# EAGLE design USB_Isolator (EAGLE 5.06)
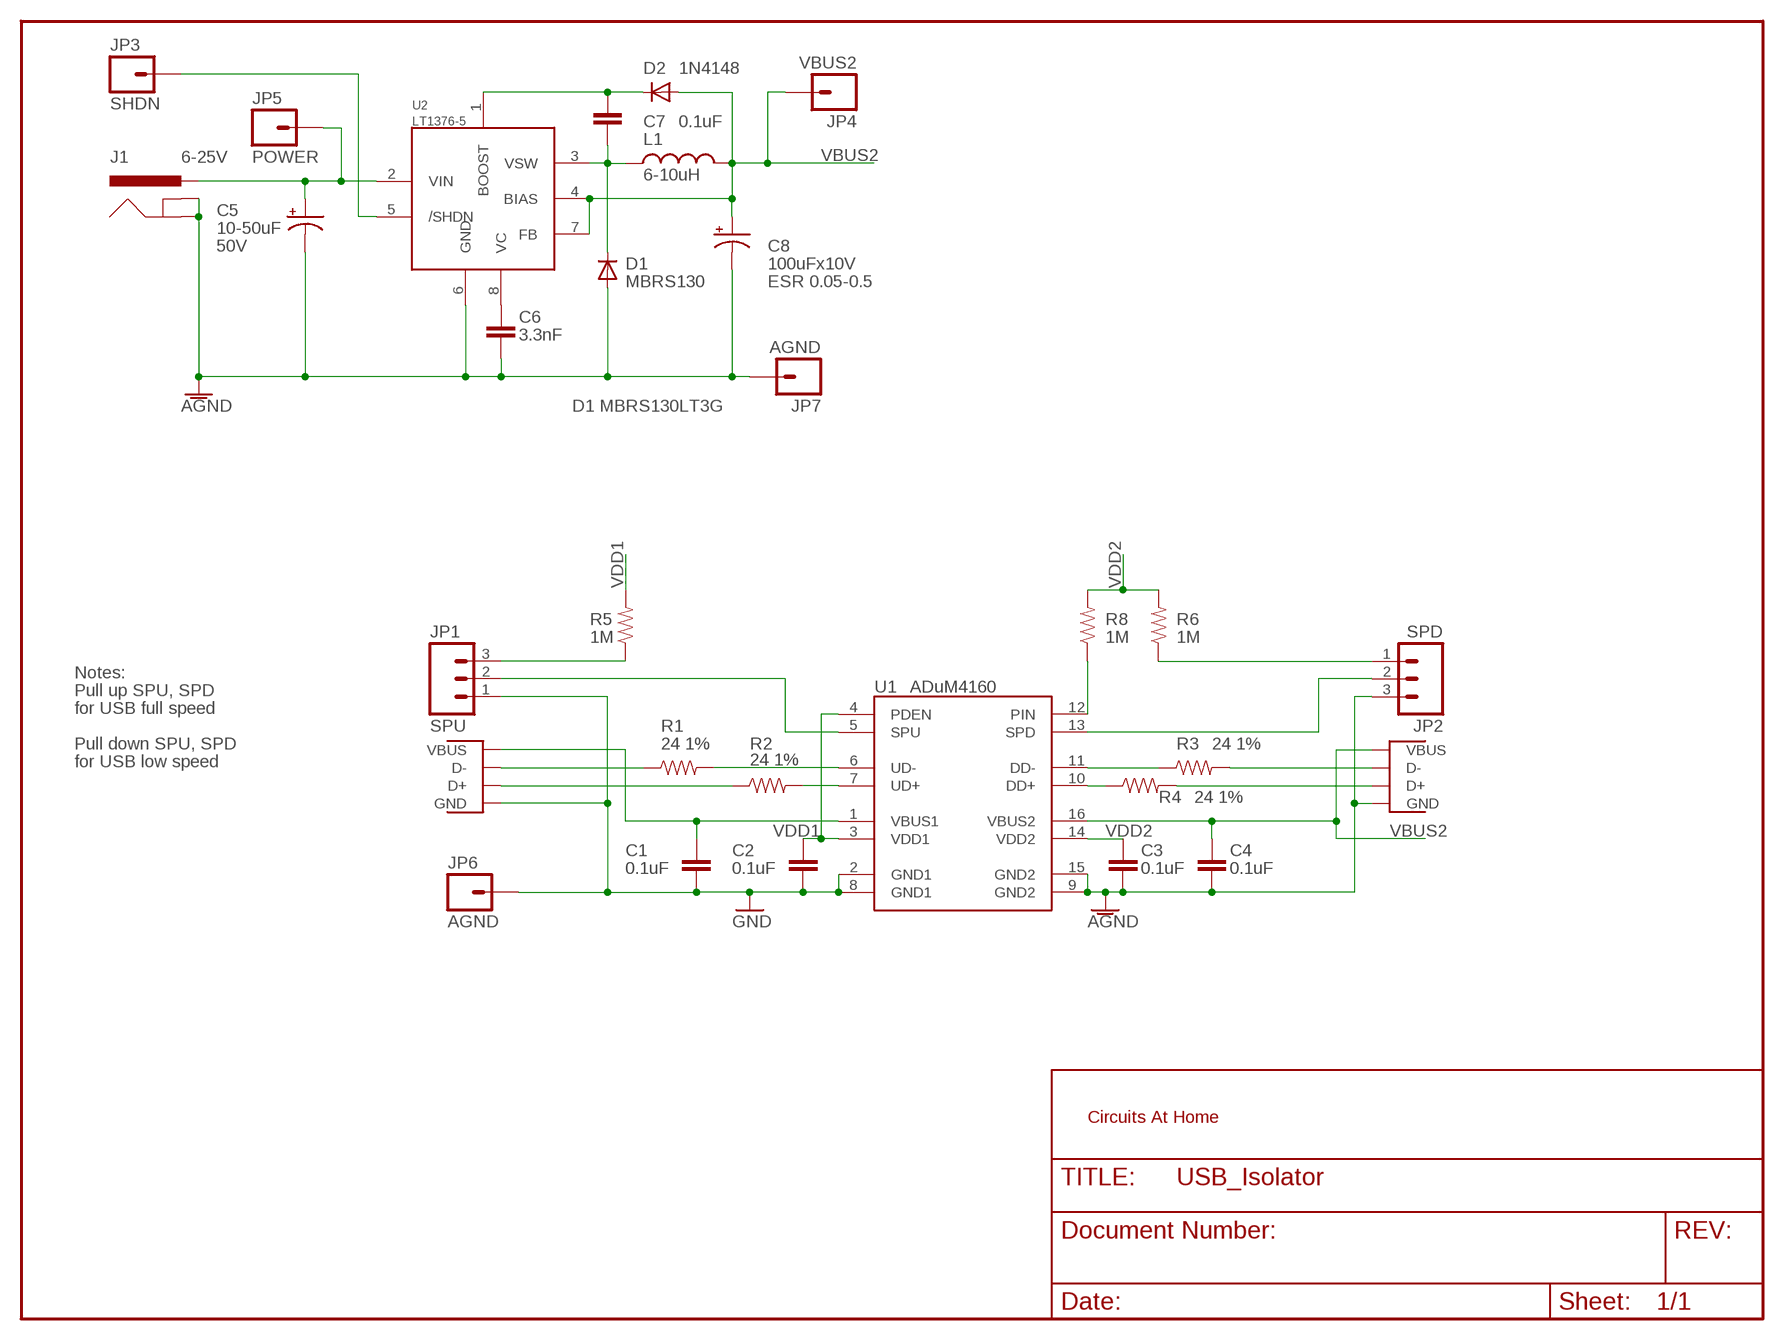
[diagram p0: schematic, sheet 1]

## Parts
C1  0.1uF  CAP1206  [1206]
C2  0.1uF  CAP1206  [1206]
C3  0.1uF  CAP1206  [1206]
C4  0.1uF  CAP1206  [1206]
C5  10-50uF  CAP_POL7343  [EIA7343]
C6  3.3nF  CAP1206  [1206]
C7  0.1uF  CAP1206  [1206]
C8  100uFx10V  CAP_POL7343  [EIA7343]
D1  MBRS130  DIODE-403A  [403A]
D2  1N4148  DIODE-SOD123  [SOD-123]
J1  6-25V  POWER_JACKPTH  [POWER_JACK_PTH]
JP1  SPU  M03PTH  [1X03]
JP2  SPD  M03PTH  [1X03]
JP3  SHDN  M01PTH  [1X01]
JP4  VBUS2  M01PTH  [1X01]
JP5  POWER  M01PTH  [1X01]
JP6  AGND  M01PTH  [1X01]
JP7  AGND  M01PTH  [1X01]
L1  6-10uH  INDUCTOR-CDRH5D18  [CDRH5D18]
R1  24 1%  RESISTOR1206  [1206]
R2  24 1%  RESISTOR1206  [1206]
R3  24 1%  RESISTOR1206  [1206]
R4  24 1%  RESISTOR1206  [1206]
R5  1M  RESISTOR1206  [1206]
R6  1M  RESISTOR1206  [1206]
R8  1M  RESISTOR1206  [1206]
U1  ADuM4160  ADUM4160  [SO16W]
U2  LT1376-5  LT1376-SO  [SO08]
X1  USB U  USBPTH  [USB-B-PTH]
X2  USB D  USB-A-H  [USB-A-H]

## Nets
AGND: C3.2 C4.2 C5.C(-) C6.1 C8.C(-) D1.A J1.GND J1.GNDBREAK JP2.3 JP7.1 U1.9(GND2) U1.15(GND2) U2.6(GND) X2.GND
BOOST: C7.2 D2.K(C) U2.1(BOOST)
GND: C1.2 C2.2 JP1.1 JP6.1 U1.2(GND1) U1.8(GND1) X1.GND
N$1: R1.1 X1.D-
N$2: R2.1 X1.D+
N$3: R3.2 X2.D-
N$4: R4.2 X2.D+
N$5: R2.2 U1.7(UD+)
N$7: R1.2 U1.6(UD-)
N$8: JP1.3 R5.1
N$9: JP2.1 R6.1
N$10: C5.A(+) J1.PWR JP5.1 U2.2(VIN)
N$11: R4.1 U1.10(DD+)
N$13: JP1.2 U1.5(SPU)
N$14: R8.1 U1.12(PIN)
N$15: JP2.2 U1.13(SPD)
N$16: R3.1 U1.11(DD-)
N$18: JP3.1 U2.5(/SHDN)
N$19: C6.2 U2.8(VC)
N$21: C7.1 D1.C L1.1 U2.3(VSW)
VBUS1: C1.1 U1.1(VBUS1) X1.VBUS
VBUS2: C4.1 C8.A(+) D2.A JP4.1 L1.2 U1.16(VBUS2) U2.4(BIAS) U2.7(FB) X2.VBUS
VDD1: C2.1 R5.2 U1.3(VDD1) U1.4(PDEN)
VDD2: C3.1 R6.2 R8.2 U1.14(VDD2)

## Notes on the sheet
- 50V
- ESR 0.05-0.5
- D1 MBRS130LT3G
- Notes:
- Pull up SPU, SPD
- for USB full speed
- Pull down SPU, SPD
- for USB low speed

## Library data of the parts
C1-C4 C6 C7 = CH_passive:CAP: Capacitor Standard 0603 ceramic capacitor, and 0.1" leaded capacitor.
C5 C8 = CH_passive:CAP_POL: Capacitor Polarized These are standard SMD and PTH capacitors. Normally 10uF, 47uF, and 100uF in electrolytic and tantalum varieties. Always verify the external diameter of the through hole cap, it varies with capacity, voltage, and manufacturer. The EIA devices should be standard.
D1 D2 = CH_semiconductors:DIODE: Diode These are standard reverse protection diodes and small signal diodes. SMA package can handle up to about 1A. SOD-323 can handle about 200mA. What the SOD-323 package when ordering, there are some mfgs out there that are 5-pin packages.
J1 = CH_connectors:POWER_JACK: Power Jack This is the standard 5.5mm barrel jack for power. The PTH is the most common, proven, reliable, footprint. All others are experimental. The Slot footprint only works if the mill layer is transmitted to the PCB fab house so be warned. Spark Fun Electronics SKU : PRT-00119. Mating wall wart : TOL-00298 (and others)
JP1 JP2 = CH_connectors:M03: Header 3 Standard 3-pin 0.1" header. Use with straight break away headers (SKU : PRT-00116), right angle break away headers (PRT-00553), swiss pins (PRT-00743), machine pins (PRT-00117), and female headers (PRT-00115). Molex polarized connector foot print use with SKU : PRT-08232 with associated crimp pins and housings.
JP3-JP7 = CH_connectors:M01: Header 1 Standard 1-pin 0.1" header. Use with straight break away headers (SKU : PRT-00116), right angle break away headers (PRT-00553), swiss pins (PRT-00743), machine pins (PRT-00117), and female headers (PRT-00115).
L1 = CH_passive:INDUCTOR: Inductors Basic Inductor
R1-R6 R8 = CH_passive:RESISTOR: Resistor Basic schematic elements and footprints for 0603, 1206, and PTH 1/10th watt (small) resistors.
U1 = CH_Analog_Devices:ADUM4160: Analog Devices Low/Full Speed USB Isolator
U2 = CH_Linear_technology:LT1376: Linear Technology 1.5A 500kHz Step-down switching regulator
X1 X2 = CH_connectors:USB: USB Connectors USB-B-PTH is fully proven SKU : PRT-00139 USB-miniB is fully proven SKU : PRT-00587 USB-A-PCB is untested. USB-A-H is C@H proven USB-B-SMT is throughly reviewed, but untested. Needs silkscreen touching up. USB-A-S has not been used/tested USB-MB-H has not been used/tested

## Board
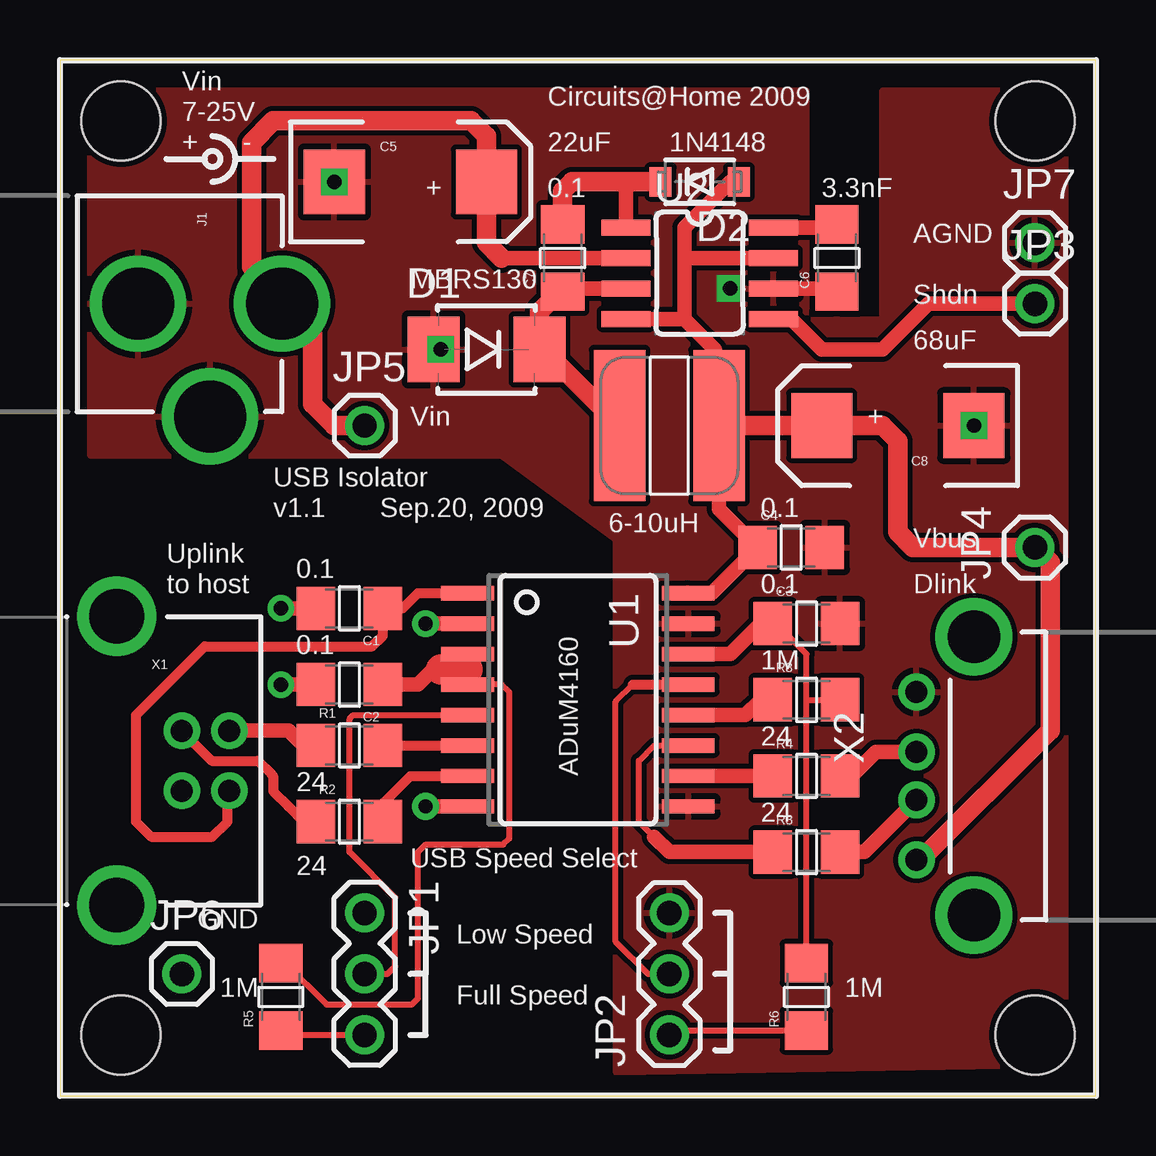
[diagram p1: board, top side]
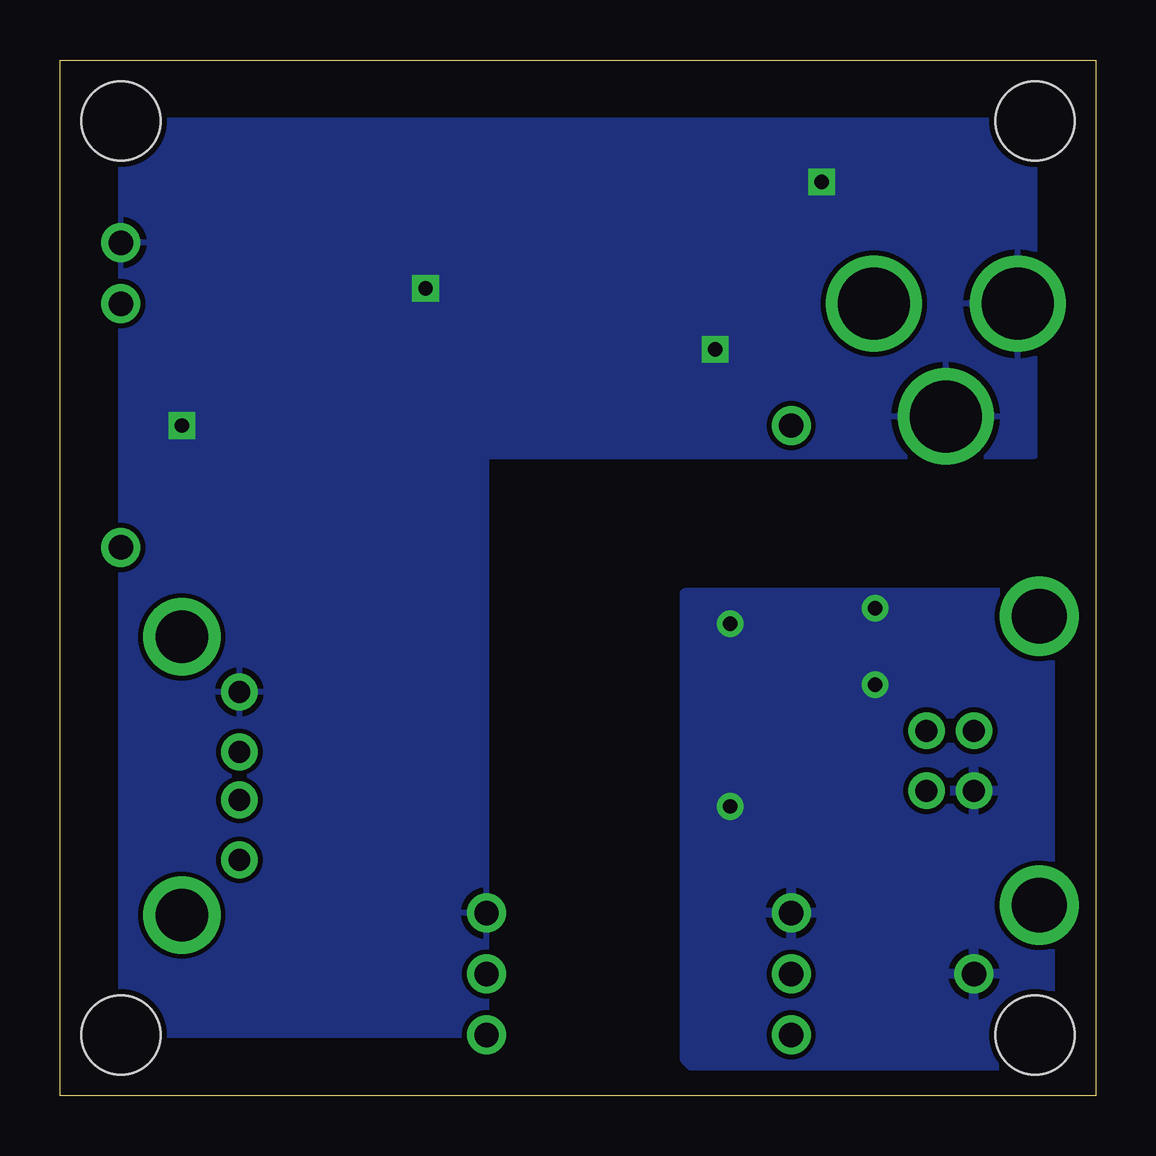
[diagram p2: board, bottom side, seen from below]

Size 43.18 x 43.18 mm. Coordinates in mm from the lower left corner, seen from the top.
Outline: 0,0 43.18,0 43.18,43.18 0,43.18 0,0
Copper layers (1*16): Top 0.035mm / dielectric 1.5mm / Bottom 0.035mm
Design rules "CHome": minimum track width 8mil, minimum drill 20mil, track to track 8mil, track to pad 8mil, pad to pad 8mil, via to via 8mil, smd to smd 8mil, copper to edge 10mil, drill to drill 8mil, minimum pad ring 12mil, minimum via ring 10mil, stop-mask expansion 4mil, vias tented up to drill 25mil, thermal gap 10mil

### Footprints (pad centres in the part's own frame; a part is rotated, then mirrored left to right if it is on the bottom)
1206 = smd 1.6 x 1.8: 1 -1.4,0; 2 1.4,0
EIA7343 = smd 2.55 x 2.7: A 3.17,0; C -3.17,0
403A = smd 2.159 x 2.743: A -2.21,0; C 2.21,0
SOD-123 = smd 0.91 x 1.22: A -1.635,0; K 1.635,0
POWER_JACK_PTH = drill 2.997 round: GND 0,7.7; GNDBREAK 4.7,10.7; PWR 0,13.7
1X03 = drill 1.016 round: 1 0,0; 2 2.54,0; 3 5.08,0
1X01 = drill 1.016 round: 1 0,0
CDRH5D18 = smd 2.15 x 6.3: 1 -2.075,0; 2 2.075,0
SO16W = smd 0.6 x 2.2: 1 -4.445,-4.6; 2 -3.175,-4.6; 3 -1.905,-4.6; 4 -0.635,-4.6; 5 0.635,-4.6; 6 1.905,-4.6; 7 3.175,-4.6; 8 4.445,-4.6; 9 4.445,4.6; 10 3.175,4.6; 11 1.905,4.6; 12 0.635,4.6; 13 -0.635,4.6; 14 -1.905,4.6; 15 -3.175,4.6; 16 -4.445,4.6
SO08 = smd 0.66 x 2.032: 1 -1.905,-3.073; 2 -0.635,-3.073; 3 0.635,-3.073; 4 1.905,-3.073; 5 1.905,3.073; 6 0.635,3.073; 7 -0.635,3.073; 8 -1.905,3.073
STAND-OFF = hole 3.302: 0,0
USB-B-PTH = drill 0.914 round: D+ 0,1.25; D- 1.981,1.25; GND 0,-1.25; VBUS 1.981,-1.25 | drill 2.286 round: P$1 -2.718,-6.02; P$2 -2.718,6.02
USB-A-H = drill 0.914 round: D+ 2.4,-1; D- 2.4,1; GND 2.4,-3.5; VBUS 2.4,3.5 | drill 2.2 round: GND@1 0,5.8; GND@2 0,-5.8

### Placement (x,y rotation side)
C1  12.06,20.32 180 top
C2  12.06,17.14 180 top
C3  31.11,19.68 0 top
C4  30.48,22.86 0 top
C5  14.61,38.1 0 top
C6  32.38,34.92 90 top
C7  20.95,34.92 90 top
C8  34.92,27.94 180 top
D1  17.78,31.11 0 top
D2  26.67,38.1 180 top
J1  -4.45,33.02 270 top
JP1  12.7,7.62 270 top
JP2  25.4,2.54 90 top
JP3  40.64,33.02 0 top
JP4  40.64,22.86 90 top
JP5  12.7,27.94 0 top
JP6  5.08,5.08 0 top
JP7  40.64,35.56 0 top
L1  25.4,27.94 0 top
R1  12.06,14.61 0 top
R2  12.06,11.43 0 top
R3  31.11,10.16 0 top
R4  31.11,13.34 0 top
R5  9.21,4.13 90 top
R6  31.11,4.13 90 top
R8  31.11,16.51 0 top
U1  21.59,16.51 270 top
U2  26.67,34.29 270 top
U$1  [STAND-OFF]  40.64,40.64 0 top
U$2  [STAND-OFF]  2.54,40.64 0 top
U$3  [STAND-OFF]  40.64,2.54 0 top
U$4  [STAND-OFF]  2.54,2.54 0 top
X1  5.08,13.97 0 top
X2  38.1,13.34 180 top

### Tracks (layer width: path | path; a pad name or v marks a point on that pad's centre or on a via)
AGND  (via drill 0.6)
  Top 0.61: U2.6 32.89,33.66 C6.1
  other vias: 27.94,33.66 11.43,38.1 15.88,31.11 38.1,27.94
  pour Top: 23.18,23.18 18.41,26.67 1.27,26.67 1.27,41.91 31.11,41.91 31.11,32.38 34.29,32.38 34.29,41.91 41.91,41.91 41.91,1.27 23.18,0.95
  pour Bottom: 40.64,2.54 25.4,2.54 25.4,26.67 2.54,26.67 2.54,40.64 40.64,40.64
BOOST
  Top 0.61: C7.2 21.09,36.2 | U2.1 23.6,38.02 23.67,38.1
  Top 0.813: D2.K 23.67,38.1 21.34,38.1 20.95,37.72 C7.2
GND  (via drill 0.6)
  Top 0.61: U1.2 v15.24,19.68 | v9.21,20.32 C1.2 | v9.21,17.14 C2.2 | U1.8 v15.24,12.06
  pour Bottom: 1.91,20.95 17.14,20.95 17.14,1.52 16.89,1.27 2.16,1.27 1.91,1.52
N$1
  Top 0.406: 10.16,14.61 R1.1 | X1.D- 7.08,15.24
  Top 0.61: 10.16,14.61 9.53,15.24 7.08,15.24
N$2
  Top 0.254: 10.16,11.43 R2.1
  Top 0.406: X1.D+ 6.33,13.97 8.26,13.97 8.82,13.41 arc-45 8.89,13.23 8.89,12.7 9.53,12.06 10.16,11.43
N$3
  Top 0.406: R3.2 33.02,10.16
  Top 0.61: 33.02,10.16 33.52,10.16 X2.D-
N$4
  Top 0.406: R4.2 33.02,13.34
  Top 0.61: X2.D+ 34.02,14.34 33.02,13.34
N$5
  Top 0.406: U1.7 14.61,13.34 13.46,12.2 R2.2
N$7
  Top 0.406: R1.2 U1.6
N$8
  Top 0.254: R5.1 9.21,2.54 JP1.3
N$9
  Top 0.254: R6.1 25.59,2.73 JP2.1
N$10
  Top 0.61: 18.41,34.92 U2.2 | C5.A | J1.PWR 9.26,33.29
  Top 0.813: JP5.1 11.43,27.94 10.53,28.84 10.53,31.75 J1.PWR | 18.41,34.92 17.78,35.56 C5.A | C5.A 17.77,40.01 17.14,40.64 8.89,40.64 7.99,39.73 7.99,34.56 9.26,33.29
N$11
  Top 0.61: U1.10 27.94,13.34 R4.1
N$13
  Top 0.254: U1.5 12.32,15.88 arc90 12.06,15.62 12.06,10.16 13.97,8.26 13.97,5.4 13.65,5.08 JP1.2
N$14
  Top 0.406: 29.21,16.51 R8.1
  Top 0.61: 29.21,16.51 28.57,15.88 U1.12
N$15
  Top 0.254: JP2.2 24.51,5.08 23.16,6.43 23.16,16.43 23.88,17.14
  Top 0.406: 23.88,17.14 U1.13
N$16
  Top 0.254: U1.11 24.77,14.61 24.13,13.97 24.13,11.43 24.77,10.79
  Top 0.61: R3.1 25.4,10.16 24.77,10.79
N$18
  Top 0.61: U2.5 30.48,32.38 31.75,31.11 34.29,31.11 36.2,33.02 JP3.1
N$19
  Top 0.61: U2.8 32.89,36.2 C6.2
N$21
  Top 0.61: U2.3 20.95,33.66 C7.1 | D1.C 20.15,31.11
  Top 0.813: D1.C 19.99,32.69 20.95,33.66 | 20.15,31.11 L1.1
VBUS1
  Top 0.406: X1.VBUS 6.99,12.64 6.99,11.43 6.35,10.79 3.81,10.79 3.17,11.43 3.17,15.88 6.03,18.73 13.02,18.73 13.46,19.18 C1.1 14.29,20.32 14.92,20.95 U1.1
VBUS2
  Top 0.406: X2.VBUS 35.87,9.84
  Top 0.61: U1.16 26.16,20.98 | U1.16 26.04,20.95 | 29.84,34.92 U2.7 26.04,34.92 | 26.04,32.38 U2.4 | 26.04,32.38 27.3,31.11 27.3,28.11 L1.2 27.48,24.46 C4.1 27.18,20.95 U1.16 | 26.04,32.38 26.04,34.92 | D2.A 27.94,38.1 26.04,36.2 26.04,34.92
  Top 0.813: 35.87,9.84 41.27,15.24 41.27,22.23 JP4.1 35.56,22.86 34.92,23.5 34.92,27.3 34.29,27.94 C8.A L1.2
VDD1
  Top 0.254: U1.4 18.41,17.14 18.73,16.83 18.73,10.73 18.48,10.48 15.24,10.48 14.92,10.16 14.92,4.06 14.67,3.81 11.11,3.81 9.39,5.53 R5.2
  Top 0.406: U1.4 16.99,17.78 U1.3
  Top 0.61: 15.88,17.78 15.56,17.78 14.92,17.14 C2.1
  Top 1.27: 16.99,17.78 15.88,17.78
VDD2
  Top 0.254: C3.1 29.84,19.68 31.11,18.41 31.11,16.51 | R6.2 31.11,16.51 | 31.11,16.51 R8.2
  Top 0.406: C3.1 29.21,19.68
  Top 0.61: 29.21,19.68 27.94,18.41 U1.14

### Text on the board
tPlace: Vin | 7-25V | Circuits@Home 2009 | + | - | 22uF | 1N4148 | + | 0.1 | 3.3nF | AGND | MBRS130 | Shdn | 68uF | Vin | + | USB Isolator | v1.1 | Sep.20, 2009 | 0.1 | 6-10uH | Vbus | Uplink | 0.1 | to host | 0.1 | Dlink | 0.1 | 1M | 24 | 24 | ADuM4160 | 24 | USB Speed Select | 24 | GND | Low Speed | 1M | Full Speed | 1M